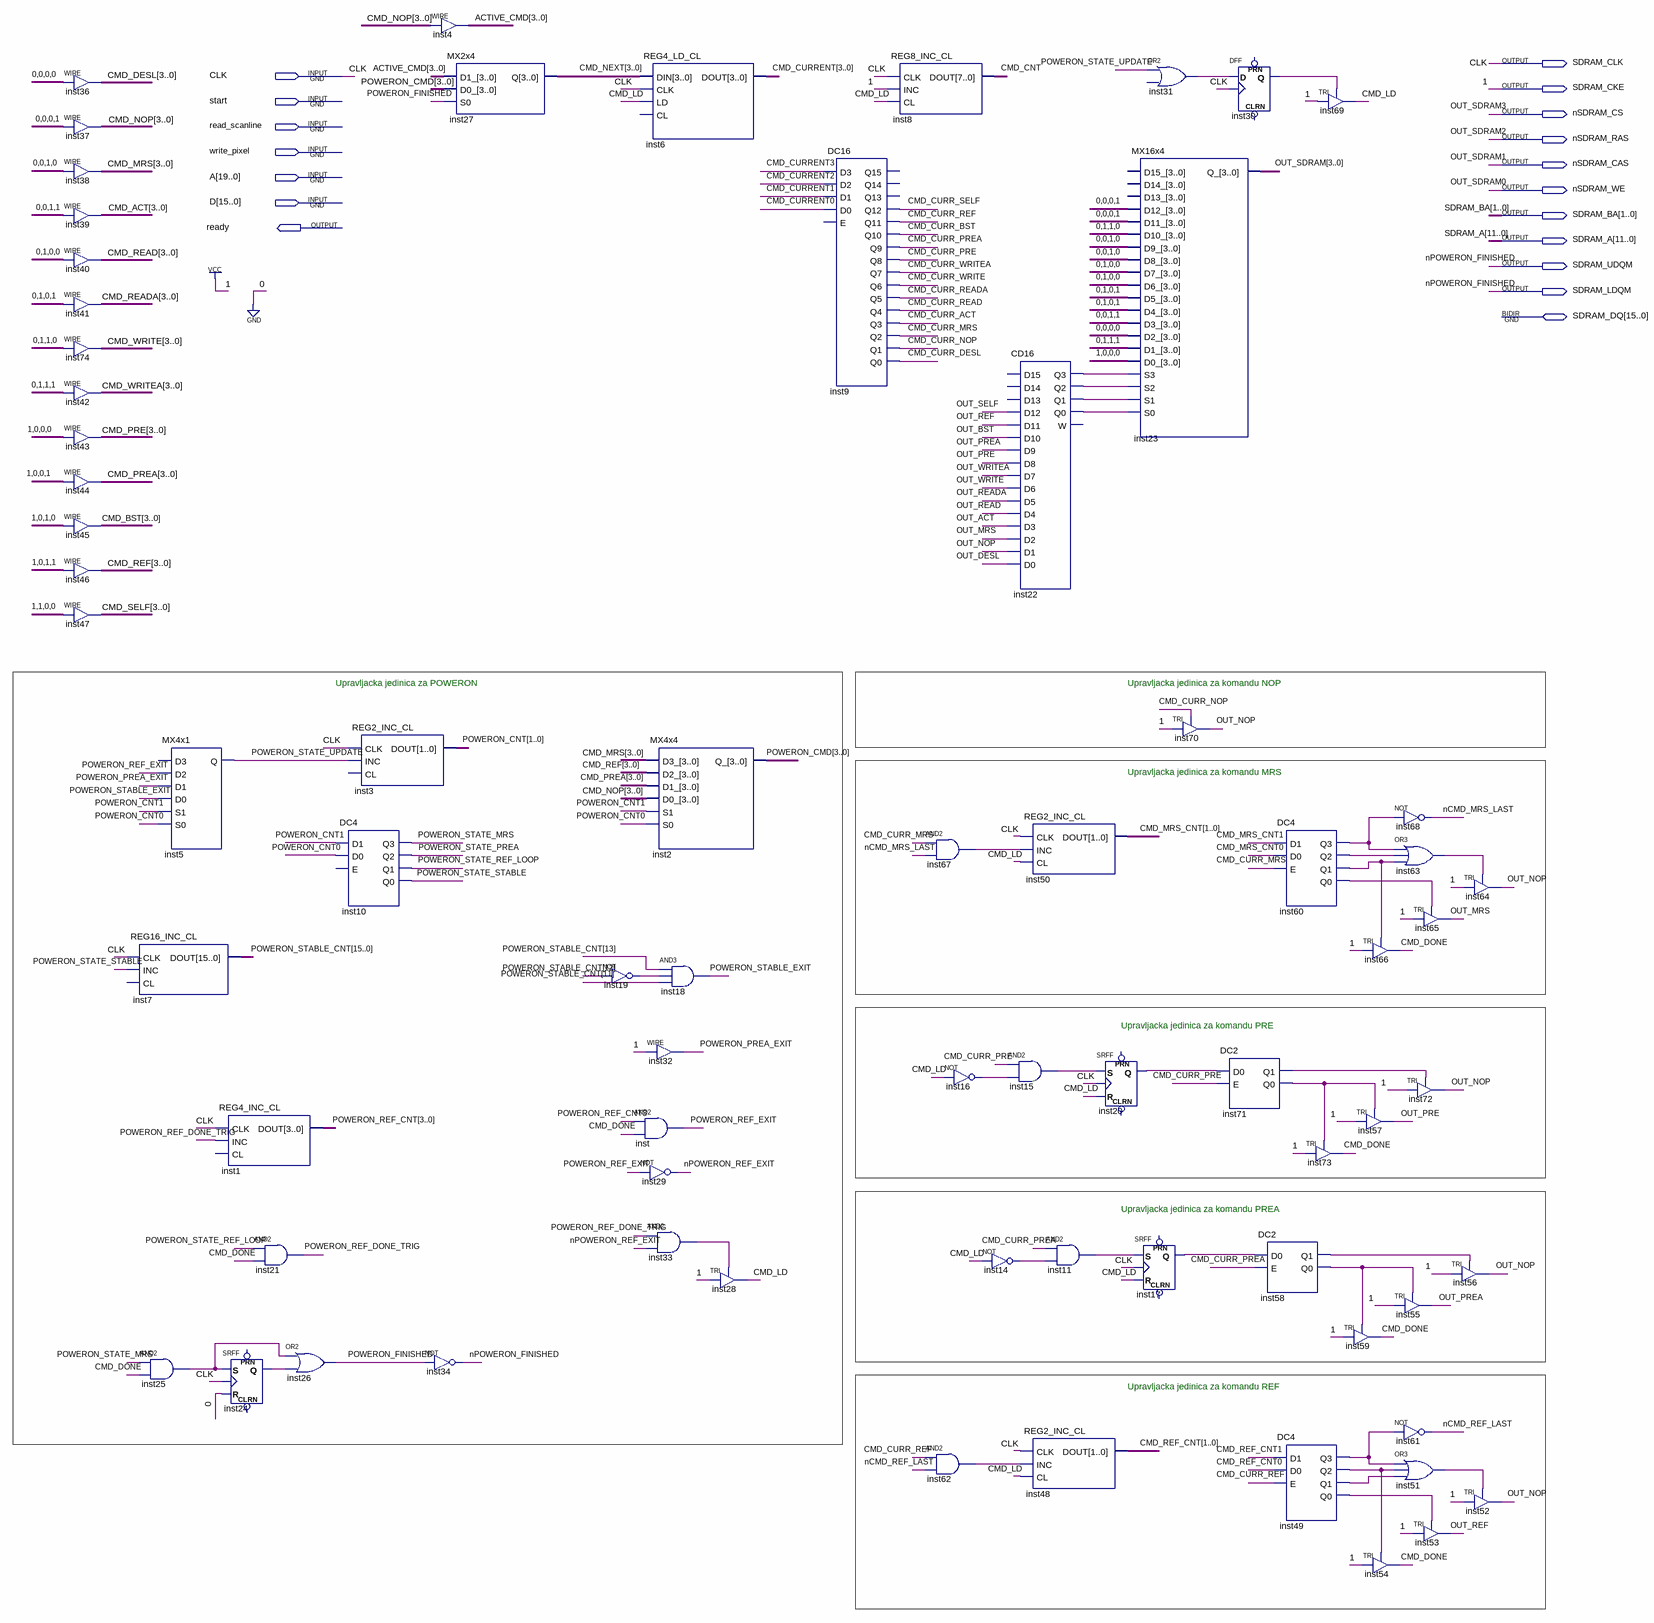
[diagram p0: schematic sheet]
// Quartus schematic vram-controller.bdf as structural Verilog: 72 symbols, 18 pins
module \vram-controller  (
  input  CLK,
  input  start,
  input  read_scanline,
  input  write_pixel,
  input  [19:0] A,
  input  [15:0] D,
  inout  [15:0] SDRAM_DQ,
  output SDRAM_CLK,
  output SDRAM_CKE,
  output nSDRAM_CS,
  output nSDRAM_RAS,
  output nSDRAM_CAS,
  output nSDRAM_WE,
  output [1:0] SDRAM_BA,
  output ready,
  output [11:0] SDRAM_A,
  output SDRAM_UDQM,
  output SDRAM_LDQM
);

  wire CMD_CNT, CMD_CURR_ACT, CMD_CURR_BST, CMD_CURR_DESL, CMD_CURR_MRS, CMD_CURR_NOP, CMD_CURR_PRE,
       CMD_CURR_PREA, CMD_CURR_READ, CMD_CURR_READA, CMD_CURR_REF, CMD_CURR_SELF, CMD_CURR_WRITE,
       CMD_CURR_WRITEA, CMD_DONE, CMD_LD, inst11_out, inst14_out, inst15_out, inst16_out, inst17_q,
       inst19_out, inst20_q, inst22_q0, inst22_q1, inst22_q2, inst22_q3, inst24_q, inst25_out, inst30_q,
       inst31_out, inst33_out, inst49_q0, inst49_q1, inst49_q2, inst49_q3, inst51_out, inst58_q0, inst58_q1,
       inst60_q0, inst60_q1, inst60_q2, inst60_q3, inst62_out, inst63_out, inst67_out, inst71_q0, inst71_q1,
       nCMD_MRS_LAST, nCMD_REF_LAST, nPOWERON_REF_EXIT, OUT_ACT, OUT_BST, OUT_DESL, OUT_MRS, OUT_NOP,
       OUT_PRE, OUT_PREA, OUT_READ, OUT_READA, OUT_REF, OUT_SELF, OUT_WRITE, OUT_WRITEA, POWERON_FINISHED,
       POWERON_PREA_EXIT, POWERON_REF_DONE_TRIG, POWERON_REF_EXIT, POWERON_STABLE_EXIT, POWERON_STATE_MRS,
       POWERON_STATE_PREA, POWERON_STATE_REF_LOOP, POWERON_STATE_STABLE, POWERON_STATE_UPDATE;
  wire [1:0] CMD_MRS_CNT, CMD_REF_CNT, POWERON_CNT;
  wire [3:0] ACTIVE_CMD, CMD_ACT, CMD_BST, CMD_CURRENT, CMD_DESL, CMD_MRS, CMD_NEXT, CMD_NOP, CMD_PRE,
       CMD_PREA, CMD_READ, CMD_READA, CMD_REF, CMD_SELF, CMD_WRITE, CMD_WRITEA, POWERON_CMD, POWERON_REF_CNT;
  wire [15:0] POWERON_STABLE_CNT;

  assign CMD_DESL = 4'b0000;  // WIRE inst36
  assign CMD_NOP = 4'b0001;  // WIRE inst37
  assign CMD_MRS = 4'b0010;  // WIRE inst38
  assign CMD_ACT = 4'b0011;  // WIRE inst39
  assign CMD_READ = 4'b0100;  // WIRE inst40
  assign CMD_READA = 4'b0101;  // WIRE inst41
  assign CMD_WRITE = 4'b0110;  // WIRE inst74
  assign CMD_WRITEA = 4'b0111;  // WIRE inst42
  assign CMD_PRE = 4'b1000;  // WIRE inst43
  assign CMD_PREA = 4'b1001;  // WIRE inst44
  assign CMD_BST = 4'b1010;  // WIRE inst45
  assign CMD_REF = 4'b1011;  // WIRE inst46
  assign CMD_SELF = 4'b1100;  // WIRE inst47
  MX4x1 inst5 (
    .D2(POWERON_REF_EXIT), .D1(POWERON_PREA_EXIT), .D0(POWERON_STABLE_EXIT), .S1(POWERON_CNT[1]),
    .S0(POWERON_CNT[0]), .Q(POWERON_STATE_UPDATE));  // open: D3
  REG16_INC_CL inst7 (.CLK(CLK), .INC(POWERON_STATE_STABLE), .DOUT(POWERON_STABLE_CNT));  // open: CL
  and inst25 (inst25_out, POWERON_STATE_MRS, CMD_DONE);
  REG4_INC_CL inst1 (.CLK(CLK), .INC(POWERON_REF_DONE_TRIG), .DOUT(POWERON_REF_CNT));  // open: CL
  and inst21 (POWERON_REF_DONE_TRIG, POWERON_STATE_REF_LOOP, CMD_DONE);
  SRFF inst24 (.S(inst25_out), .R(1'b0), .CLK(CLK), .Q(inst24_q));  // open: PRN, CLRN
  or inst26 (POWERON_FINISHED, inst25_out, inst24_q);
  REG2_INC_CL inst3 (.CLK(CLK), .INC(POWERON_STATE_UPDATE), .DOUT(POWERON_CNT));  // open: CL
  DC4 inst10 (
    .D1(POWERON_CNT[1]), .D0(POWERON_CNT[0]), .Q3(POWERON_STATE_MRS), .Q2(POWERON_STATE_PREA),
    .Q1(POWERON_STATE_REF_LOOP), .Q0(POWERON_STATE_STABLE));  // open: E
  assign ACTIVE_CMD = CMD_NOP;  // WIRE inst4
  MX2x4 inst27 (.D1_(ACTIVE_CMD), .D0_(POWERON_CMD), .S0(POWERON_FINISHED), .Q(CMD_NEXT));
  not inst34 (SDRAM_LDQM, POWERON_FINISHED);
  not inst19 (inst19_out, POWERON_STABLE_CNT[12]);
  REG4_LD_CL inst6 (.DIN(CMD_NEXT), .CLK(CLK), .LD(CMD_LD), .DOUT(CMD_CURRENT));  // open: CL
  MX4x4 inst2 (
    .D3_(CMD_MRS), .D2_(CMD_REF), .D1_(CMD_PREA), .D0_(CMD_NOP), .S1(POWERON_CNT[1]), .S0(POWERON_CNT[0]),
    .Q_(POWERON_CMD));
  and inst18 (POWERON_STABLE_EXIT, POWERON_STABLE_CNT[13], inst19_out, POWERON_STABLE_CNT[11]);
  assign POWERON_PREA_EXIT = 1'b1;  // WIRE inst32
  and inst (POWERON_REF_EXIT, POWERON_REF_CNT[3], CMD_DONE);
  not inst29 (nPOWERON_REF_EXIT, POWERON_REF_EXIT);
  and inst33 (inst33_out, POWERON_REF_DONE_TRIG, nPOWERON_REF_EXIT);
  TRI inst28 (.IN(1'b1), .OE(inst33_out), .OUT(CMD_LD));
  DC16 inst9 (
    .D3(CMD_CURRENT[3]), .D2(CMD_CURRENT[2]), .D1(CMD_CURRENT[1]), .D0(CMD_CURRENT[0]), .Q12(CMD_CURR_SELF),
    .Q11(CMD_CURR_REF), .Q10(CMD_CURR_BST), .Q9(CMD_CURR_PREA), .Q8(CMD_CURR_PRE), .Q7(CMD_CURR_WRITEA),
    .Q6(CMD_CURR_WRITE), .Q5(CMD_CURR_READA), .Q4(CMD_CURR_READ), .Q3(CMD_CURR_ACT), .Q2(CMD_CURR_MRS),
    .Q1(CMD_CURR_NOP), .Q0(CMD_CURR_DESL));  // open: E, Q15, Q14, Q13
  REG8_INC_CL inst8 (.CLK(CLK), .INC(1'b1), .CL(CMD_LD), .DOUT(CMD_CNT));
  and inst67 (inst67_out, CMD_CURR_MRS, nCMD_MRS_LAST);
  not inst16 (inst16_out, CMD_LD);
  and inst62 (inst62_out, CMD_CURR_REF, nCMD_REF_LAST);
  CD16 inst22 (
    .D12(OUT_SELF), .D11(OUT_REF), .D10(OUT_BST), .D9(OUT_PREA), .D8(OUT_PRE), .D7(OUT_WRITEA),
    .D6(OUT_WRITE), .D5(OUT_READA), .D4(OUT_READ), .D3(OUT_ACT), .D2(OUT_MRS), .D1(OUT_NOP), .D0(OUT_DESL),
    .Q3(inst22_q3), .Q2(inst22_q2), .Q1(inst22_q1), .Q0(inst22_q0));  // open: D15, D14, D13, W
  REG2_INC_CL inst50 (.CLK(CLK), .INC(inst67_out), .CL(CMD_LD), .DOUT(CMD_MRS_CNT));
  and inst15 (inst15_out, CMD_CURR_PRE, inst16_out);
  not inst14 (inst14_out, CMD_LD);
  REG2_INC_CL inst48 (.CLK(CLK), .INC(inst62_out), .CL(CMD_LD), .DOUT(CMD_REF_CNT));
  and inst11 (inst11_out, CMD_CURR_PREA, inst14_out);
  SRFF inst20 (.S(inst15_out), .R(CMD_LD), .CLK(CLK), .Q(inst20_q));  // open: PRN, CLRN
  buf inst31 (inst31_out, POWERON_STATE_UPDATE);  // OR2 open: IN2
  MX16x4 inst23 (
    .D12_(4'b0001), .D11_(4'b0001), .D10_(4'b0110), .D9_(4'b0010), .D8_(4'b0010), .D7_(4'b0100),
    .D6_(4'b0100), .D5_(4'b0101), .D4_(4'b0101), .D3_(4'b0011), .D2_(4'b0000), .D1_(4'b0111), .D0_(4'b1000),
    .S3(inst22_q3), .S2(inst22_q2), .S1(inst22_q1), .S0(inst22_q0),
    .Q_({nSDRAM_CS, nSDRAM_RAS, nSDRAM_CAS, nSDRAM_WE}));  // open: D15_, D14_, D13_
  TRI inst70 (.IN(1'b1), .OE(CMD_CURR_NOP), .OUT(OUT_NOP));
  SRFF inst17 (.S(inst11_out), .R(CMD_LD), .CLK(CLK), .Q(inst17_q));  // open: PRN, CLRN
  DC2 inst71 (.D0(inst20_q), .E(CMD_CURR_PRE), .Q1(inst71_q1), .Q0(inst71_q0));
  DFF inst30 (.CLK(CLK), .D(inst31_out), .Q(inst30_q));  // open: CLRN, PRN
  DC4 inst60 (
    .D1(CMD_MRS_CNT[1]), .D0(CMD_MRS_CNT[0]), .E(CMD_CURR_MRS), .Q3(inst60_q3), .Q2(inst60_q2),
    .Q1(inst60_q1), .Q0(inst60_q0));
  DC2 inst58 (.D0(inst17_q), .E(CMD_CURR_PREA), .Q1(inst58_q1), .Q0(inst58_q0));
  DC4 inst49 (
    .D1(CMD_REF_CNT[1]), .D0(CMD_REF_CNT[0]), .E(CMD_CURR_REF), .Q3(inst49_q3), .Q2(inst49_q2),
    .Q1(inst49_q1), .Q0(inst49_q0));
  TRI inst69 (.IN(1'b1), .OE(inst30_q), .OUT(CMD_LD));
  TRI inst73 (.IN(1'b1), .OE(inst71_q0), .OUT(CMD_DONE));
  TRI inst66 (.IN(1'b1), .OE(inst60_q1), .OUT(CMD_DONE));
  TRI inst57 (.IN(1'b1), .OE(inst71_q0), .OUT(OUT_PRE));
  TRI inst59 (.IN(1'b1), .OE(inst58_q0), .OUT(CMD_DONE));
  TRI inst54 (.IN(1'b1), .OE(inst49_q2), .OUT(CMD_DONE));
  not inst68 (nCMD_MRS_LAST, inst60_q3);
  or inst63 (inst63_out, inst60_q3, inst60_q2, inst60_q1);
  TRI inst65 (.IN(1'b1), .OE(inst60_q0), .OUT(OUT_MRS));
  TRI inst72 (.IN(1'b1), .OE(inst71_q1), .OUT(OUT_NOP));
  TRI inst55 (.IN(1'b1), .OE(inst58_q0), .OUT(OUT_PREA));
  not inst61 (nCMD_REF_LAST, inst49_q3);
  or inst51 (inst51_out, inst49_q3, inst49_q2, inst49_q1);
  TRI inst53 (.IN(1'b1), .OE(inst49_q0), .OUT(OUT_REF));
  TRI inst64 (.IN(1'b1), .OE(inst63_out), .OUT(OUT_NOP));
  TRI inst56 (.IN(1'b1), .OE(inst58_q1), .OUT(OUT_NOP));
  TRI inst52 (.IN(1'b1), .OE(inst51_out), .OUT(OUT_NOP));

  assign SDRAM_CKE = 1'b1;
  assign SDRAM_CLK = CLK;
  assign SDRAM_UDQM = SDRAM_LDQM;

  // Other names for the same wires on the sheet: nPOWERON_FINISHED = SDRAM_LDQM;
  //   OUT_SDRAM[3:0] = {nSDRAM_CS, nSDRAM_RAS, nSDRAM_CAS, nSDRAM_WE}; OUT_SDRAM0 = nSDRAM_WE;
  //   OUT_SDRAM1 = nSDRAM_CAS; OUT_SDRAM2 = nSDRAM_RAS; OUT_SDRAM3 = nSDRAM_CS

  // Notes on the sheet:
  //   Upravljacka jedinica za POWERON
  //   Upravljacka jedinica za komandu NOP
  //   Upravljacka jedinica za komandu MRS
  //   Upravljacka jedinica za komandu PRE
  //   Upravljacka jedinica za komandu PREA
  //   Upravljacka jedinica za komandu REF
endmodule
